# Altium schematic sheet Serializer.SchDoc
size A
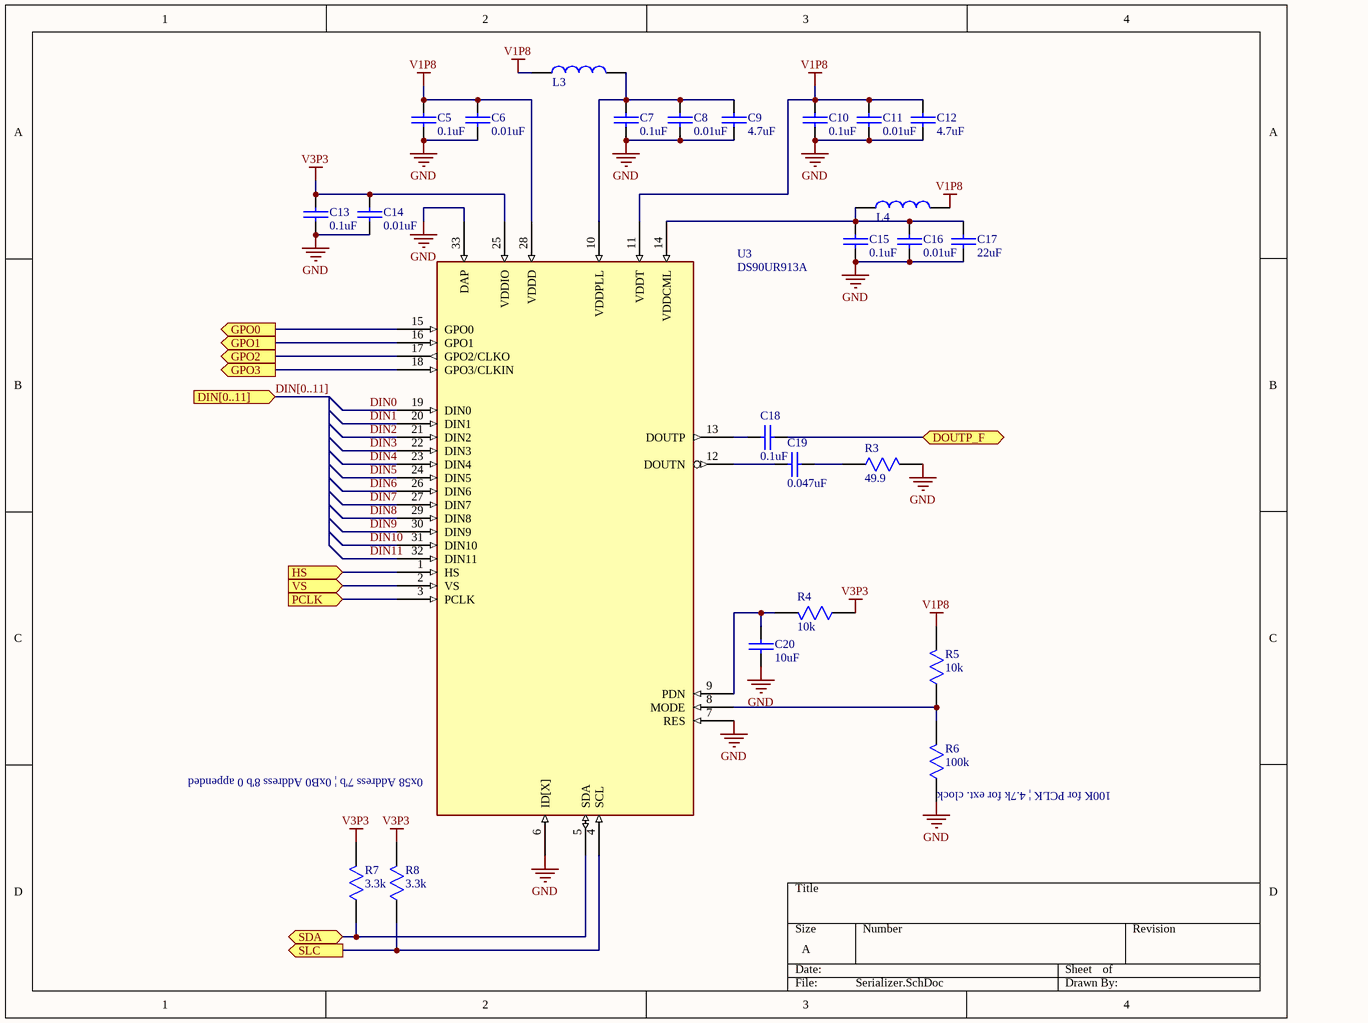
[diagram p0: Serializer.SchDoc]

## Parts
C5  0.1uF  [SMD CAP 0402]
C6  0.01uF  [SMD CAP 0402]
C7  0.1uF  [SMD CAP 0402]
C8  0.01uF  [SMD CAP 0402]
C9  4.7uF  [SMD CAP 0402]
C10  0.1uF  [SMD CAP 0402]
C11  0.01uF  [SMD CAP 0402]
C12  4.7uF  [SMD CAP 0402]
C13  0.1uF  [SMD CAP 0402]
C14  0.01uF  [SMD CAP 0402]
C15  0.1uF  [SMD CAP 0402]
C16  0.01uF  [SMD CAP 0402]
C17  22uF  [SMD Capacitor 0603]
C18  0.1uF  [SMD CAP 0402]
C19  0.047uF  [SMD CAP 0402]
C20  10uF  [SMD CAP 0402]
L3  Ferrite Bead  [BLM18KG601SN1D]  (value not drawn)
L4  Ferrite Bead  [BLM18KG601SN1D]  (value not drawn)
R3  49.9  [SMD RES 0402]
R4  10k  [SMD RES 0402]
R5  10k  [SMD RES 0402]
R6  100k  [SMD RES 0402]
R7  3.3k  [SMD RES 0402]
R8  3.3k  [SMD RES 0402]
U3  DS90UR913A  [WQFN32 for DS90UB913A]

## Ports
DIN[0..11] (in), DOUTP_F (bidir), GPO0 (out), GPO1 (out), GPO2 (out), GPO3 (out), HS (in), PCLK (in), SDA (bidir), SLC (out), VS (in)

## Nets
GND: C5.1 C6.1 C7.1 C8.1 C9.1 C10.1 C11.1 C12.1 C13.1 C14.1 C15.1 C16.1 C17.1 C20.1 R3.1 R6.0 U3.6(ID[X]) U3.7(RES) U3.33(DAP)
V1P8: C5.0 C6.0 C10.0 C11.0 C12.0 L3.1 L4.2 R5.1 U3.11(VDDT) U3.28(VDDD)
V3P3: C13.0 C14.0 R4.0 R7.1 R8.1 U3.25(VDDIO)
DIN0: U3.19(DIN0)
DIN1: U3.20(DIN1)
DIN2: U3.21(DIN2)
DIN3: U3.22(DIN3)
DIN4: U3.23(DIN4)
DIN5: U3.24(DIN5)
DIN6: U3.26(DIN6)
DIN7: U3.27(DIN7)
DIN8: U3.29(DIN8)
DIN9: U3.30(DIN9)
DIN10: U3.31(DIN10)
DIN11: U3.32(DIN11)
DOUTP_F: C18.1 ; port DOUTP_F
GPO0: U3.15(GPO0) ; port GPO0
GPO1: U3.16(GPO1) ; port GPO1
GPO2: U3.17(GPO2/CLKO) ; port GPO2
GPO3: U3.18(GPO3/CLKIN) ; port GPO3
HS: U3.1(HS) ; port HS
PCLK: U3.3(PCLK) ; port PCLK
SDA: R7.0 U3.5(SDA) ; port SDA
SLC: R8.0 U3.4(SCL) ; port SLC
VS: U3.2(VS) ; port VS
NetC7_0: C7.0 C8.0 C9.0 L3.2 U3.10(VDDPLL)
NetC15_0: C15.0 C16.0 C17.0 L4.1 U3.14(VDDCML)
NetC18_0: C18.0 U3.13(DOUTP)
NetC19_0: C19.0 U3.12(DOUTN)
NetC19_1: C19.1 R3.0
NetC20_0: C20.0 R4.1 U3.9(PDN)
NetR5_0: R5.0 R6.1 U3.8(MODE)

## Buses and harness runs
bus DIN[0..11] = port DIN[0..11]

## Notes on the sheet
- (near U3) 0x58 Address 7'b | 0xB0 Address 8'b 0 appended
- (near R6) 100K for PCLK | 4.7k for ext. clock

## Library data of the parts
C5-C20 = Capacitor: Value: C?
R3-R8 = Resistor: Value: ?
U3 = DS90UR913A: DS90UR913ASERIALIZER